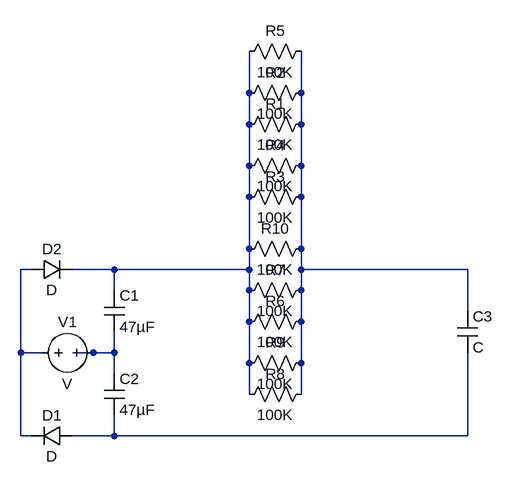
[diagram p0: schematic CapCharger.asc]
CapCharger.asc, the LTspice schematic file:
Version 4
SHEET 1 880 680
WIRE 224 -256 224 -320
WIRE 304 -256 304 -320
WIRE 224 -208 224 -256
WIRE 304 -208 304 -256
WIRE 224 -144 224 -208
WIRE 304 -144 304 -208
WIRE 224 -96 224 -144
WIRE 304 -96 304 -144
WIRE 224 -16 224 -96
WIRE 304 -16 304 -96
WIRE -112 16 -128 16
WIRE 16 16 -48 16
WIRE 224 16 224 -16
WIRE 224 16 16 16
WIRE 304 16 304 -16
WIRE 560 16 304 16
WIRE 16 48 16 16
WIRE 224 48 224 16
WIRE 304 48 304 16
WIRE 560 80 560 16
WIRE 224 96 224 48
WIRE 304 96 304 48
WIRE -128 144 -128 16
WIRE -96 144 -128 144
WIRE -16 144 -48 144
WIRE 16 144 16 112
WIRE 16 144 -16 144
WIRE 224 160 224 96
WIRE 304 160 304 96
WIRE 16 176 16 144
WIRE 224 208 224 160
WIRE 304 208 304 160
WIRE -128 272 -128 144
WIRE -112 272 -128 272
WIRE 16 272 16 240
WIRE 16 272 -48 272
WIRE 560 272 560 144
WIRE 560 272 16 272
SYMBOL res 320 -224 R90
WINDOW 0 0 56 VBottom 2
WINDOW 3 32 56 VTop 2
SYMATTR InstName R1
SYMATTR Value 100K
SYMBOL cap 0 48 R0
SYMATTR InstName C1
SYMATTR Value 47µF
SYMBOL cap 0 176 R0
SYMATTR InstName C2
SYMATTR Value 47µF
SYMBOL cap 544 80 R0
SYMATTR InstName C3
SYMBOL diode -48 256 R90
WINDOW 0 0 32 VBottom 2
WINDOW 3 32 32 VTop 2
SYMATTR InstName D1
SYMBOL diode -112 32 R270
WINDOW 0 32 32 VTop 2
WINDOW 3 0 32 VBottom 2
SYMATTR InstName D2
SYMBOL voltage -112 144 R270
WINDOW 0 32 56 VTop 2
WINDOW 3 -32 56 VBottom 2
SYMATTR InstName V1
SYMBOL res 320 -272 R90
WINDOW 0 0 56 VBottom 2
WINDOW 3 32 56 VTop 2
SYMATTR InstName R2
SYMATTR Value 100K
SYMBOL res 320 -112 R90
WINDOW 0 0 56 VBottom 2
WINDOW 3 32 56 VTop 2
SYMATTR InstName R3
SYMATTR Value 100K
SYMBOL res 320 -160 R90
WINDOW 0 0 56 VBottom 2
WINDOW 3 32 56 VTop 2
SYMATTR InstName R4
SYMATTR Value 100K
SYMBOL res 320 -336 R90
WINDOW 0 0 56 VBottom 2
WINDOW 3 32 56 VTop 2
SYMATTR InstName R5
SYMATTR Value 100K
SYMBOL res 320 80 R90
WINDOW 0 0 56 VBottom 2
WINDOW 3 32 56 VTop 2
SYMATTR InstName R6
SYMATTR Value 100K
SYMBOL res 320 32 R90
WINDOW 0 0 56 VBottom 2
WINDOW 3 32 56 VTop 2
SYMATTR InstName R7
SYMATTR Value 100K
SYMBOL res 320 192 R90
WINDOW 0 0 56 VBottom 2
WINDOW 3 32 56 VTop 2
SYMATTR InstName R8
SYMATTR Value 100K
SYMBOL res 320 144 R90
WINDOW 0 0 56 VBottom 2
WINDOW 3 32 56 VTop 2
SYMATTR InstName R9
SYMATTR Value 100K
SYMBOL res 320 -32 R90
WINDOW 0 0 56 VBottom 2
WINDOW 3 32 56 VTop 2
SYMATTR InstName R10
SYMATTR Value 100K

The netlist it stands for:
* CapCharger.asc
R1 N002 N001 100K
C1 N001 N004 47µF
C2 N004 N005 47µF
C3 N002 N005 C
D1 N005 N003 D
D2 N003 N001 D
V1 N003 N004 V
R2 N002 N001 100K
R3 N002 N001 100K
R4 N002 N001 100K
R5 N002 N001 100K
R6 N002 N001 100K
R7 N002 N001 100K
R8 N002 N001 100K
R9 N002 N001 100K
R10 N002 N001 100K
.model D D
.lib standard.dio
.backanno
.end